# Altium project PROC154E3_SCH.PrjPcb (part 2 of 60)

## Sheet 11. SOC SERDES1 IF.SchDoc: SERDES INTERFACE-2
size 513 x 386 mm; Project: PROC154E2(001)_SK_AM69; Issue: 1.0; RevCode: E3; Page Create Date: March  8, 1995; Variant Name: Core Design; Schematic Page Number: 11; Page Number: 11; Page Size: C; Comment: MISTRAL_TITLEBLK_CSIZE_1; Page Count: 62; Schematic Page Count: 62; Name: PROC154E2 001 SK AM69; DsnPath: C:\Users\danie\Downloads\sprr466c\PROC154E3_RP\PROC154E3_SCH.DSN; SchematicName: SCHEMATIC1; PageName: 11. SOC SERDES1 IF; PageSize: C; TopSchematic: True
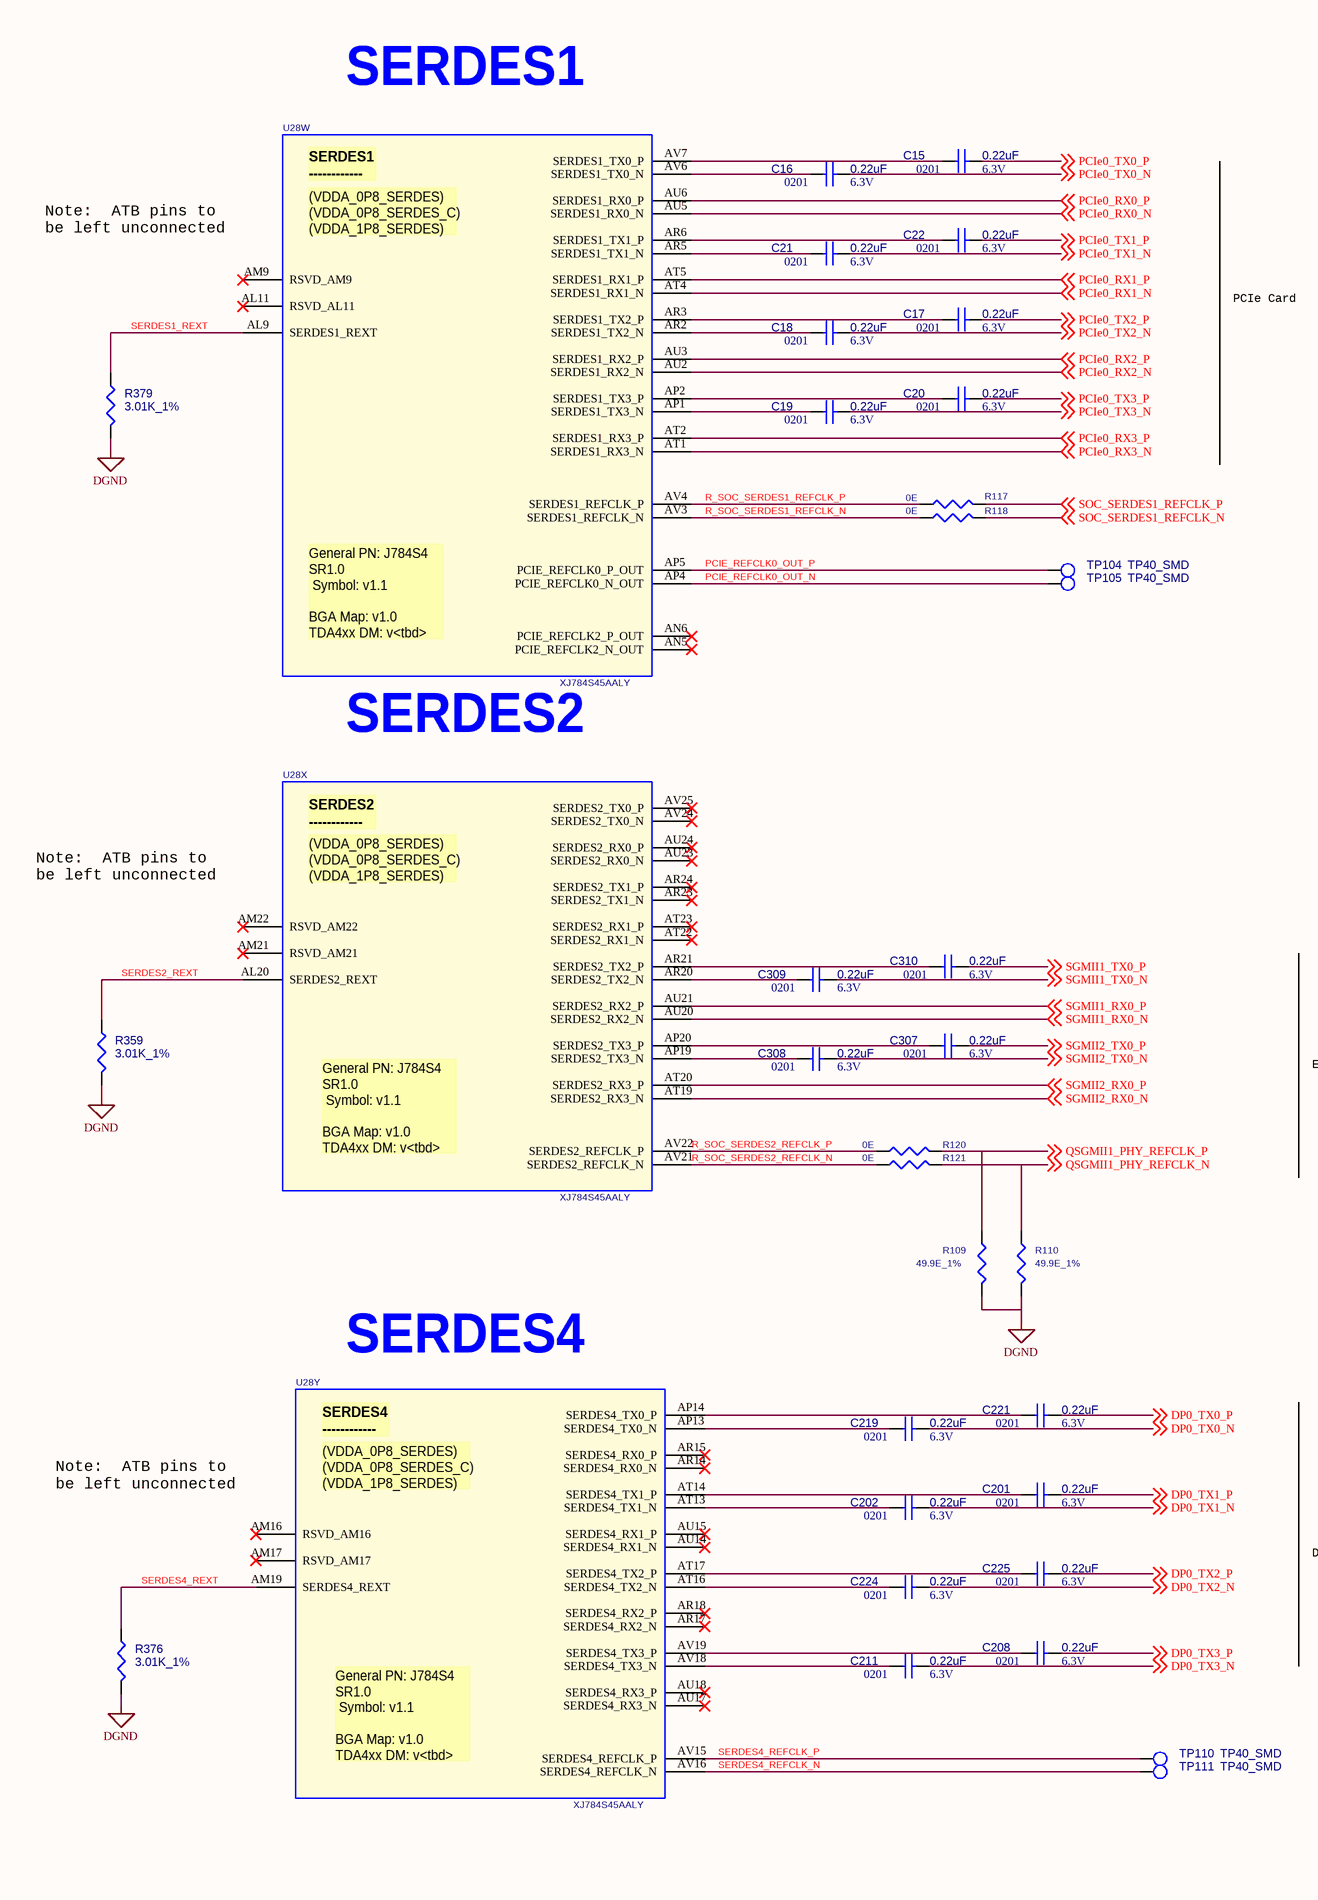
[diagram p12: 11. SOC SERDES1 IF.SchDoc, left]
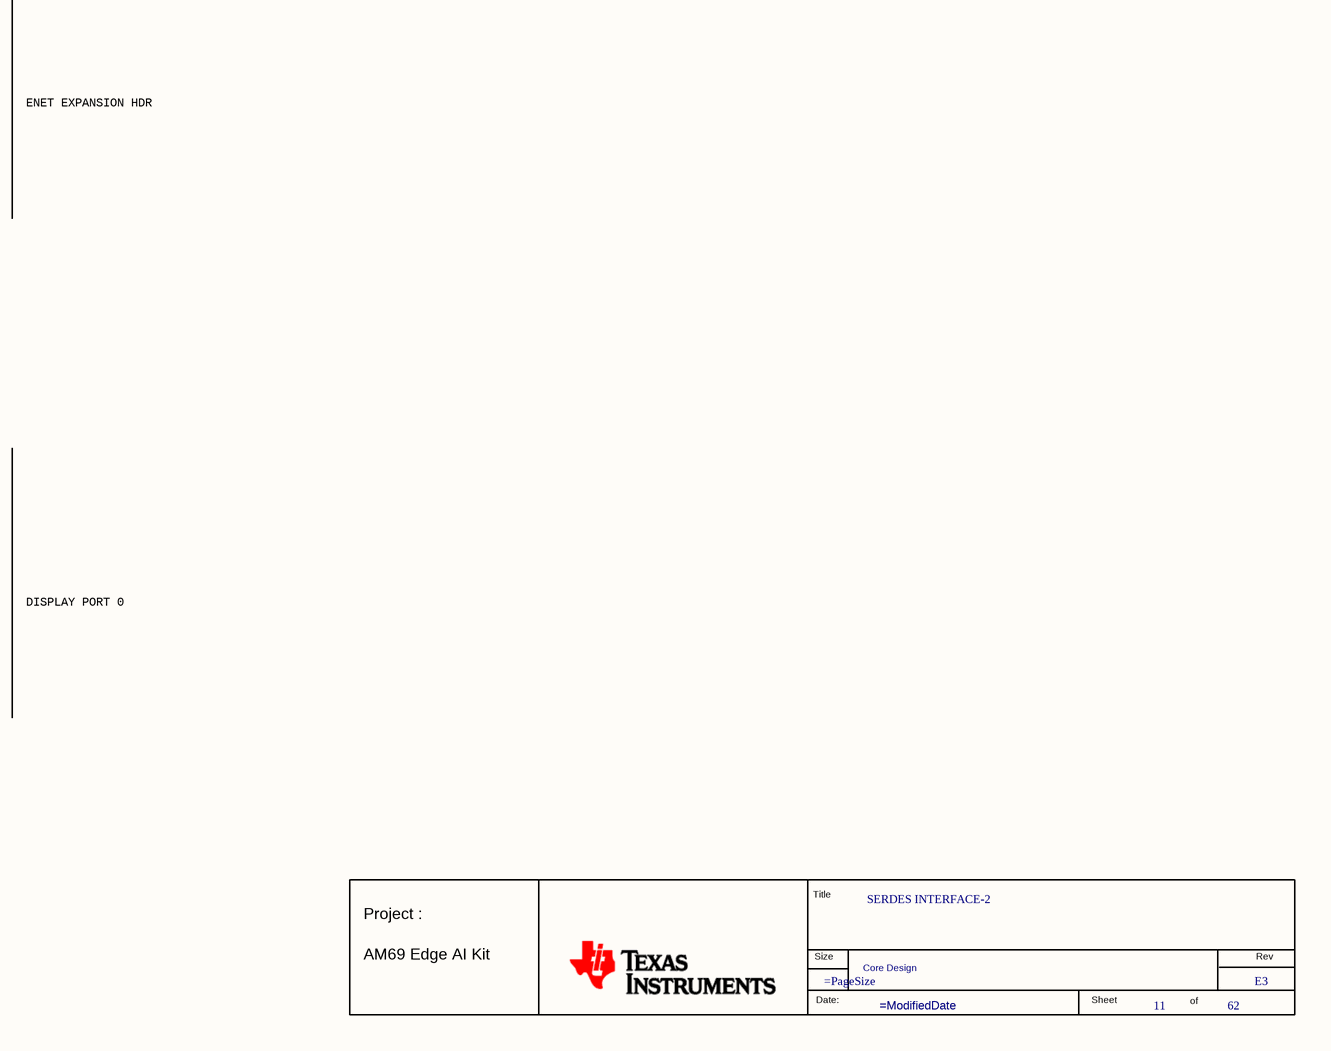
[diagram p13: 11. SOC SERDES1 IF.SchDoc, right]

### Parts
(Parts that share a designator on the sheet are numbered #1, #2 ... from top to bottom, then left to right.)
*#11  RevCode: E3  Title: SERDES INTERFACE-2  Page Number: 11  Page Count: 62  Variant Name: Core Design  (hidden comment: MISTRAL_TITLEBLK_CSIZE_1)  (graphical)
C15  0.22uF  Package: 0201  Voltage: 6.3V  [CAP0201_0-5]
C16  0.22uF  Voltage: 6.3V  Package: 0201  [CAP0201_0-5]
C17  0.22uF  Package: 0201  Voltage: 6.3V  [CAP0201_0-5]
C18  0.22uF  Voltage: 6.3V  Package: 0201  [CAP0201_0-5]
C19  0.22uF  Voltage: 6.3V  Package: 0201  [CAP0201_0-5]
C20  0.22uF  Package: 0201  Voltage: 6.3V  [CAP0201_0-5]
C21  0.22uF  Voltage: 6.3V  Package: 0201  [CAP0201_0-5]
C22  0.22uF  Package: 0201  Voltage: 6.3V  [CAP0201_0-5]
C201  0.22uF  Package: 0201  Voltage: 6.3V  [CAP0201_0-5]
C202  0.22uF  Voltage: 6.3V  Package: 0201  [CAP0201_0-5]
C208  0.22uF  Package: 0201  Voltage: 6.3V  [CAP0201_0-5]
C211  0.22uF  Voltage: 6.3V  Package: 0201  [CAP0201_0-5]
C219  0.22uF  Voltage: 6.3V  Package: 0201  [CAP0201_0-5]
C221  0.22uF  Package: 0201  Voltage: 6.3V  [CAP0201_0-5]
C224  0.22uF  Voltage: 6.3V  Package: 0201  [CAP0201_0-5]
C225  0.22uF  Package: 0201  Voltage: 6.3V  [CAP0201_0-5]
C307  0.22uF  Package: 0201  Voltage: 6.3V  [CAP0201_0-5]
C308  0.22uF  Voltage: 6.3V  Package: 0201  [CAP0201_0-5]
C309  0.22uF  Voltage: 6.3V  Package: 0201  [CAP0201_0-5]
C310  0.22uF  Package: 0201  Voltage: 6.3V  [CAP0201_0-5]
R109  49.9E_1%  [RES0402_0-5]
R110  49.9E_1%  [RES0402_0-5]
R117  0E  [RES0201_0-5]
R118  0E  [RES0201_0-5]
R120  0E  [RES0201_0-5]
R121  0E  [RES0201_0-5]
R359  3.01K_1%  [RES0201_0-5]
R376  3.01K_1%  [RES0201_0-5]
R379  3.01K_1%  [RES0201_0-5]
TP104  TP40_SMD  [TP40_SMD]
TP105  TP40_SMD  [TP40_SMD]
TP110  TP40_SMD  [TP40_SMD]
TP111  TP40_SMD  [TP40_SMD]
U28  XJ784S45AALY  [BGA1414_31-49_1230X1230_2-7]  (parts W,X,Y of 26)

### Nets
DGND: R109.2 R110.2 R359.2 R376.2 R379.2  [project net VDD_CPU_HCPS_GOSNS]
DP0_TX0_N: C219.2 ; off-sheet DP0_TX0_N
DP0_TX0_P: C221.2 ; off-sheet DP0_TX0_P
DP0_TX1_N: C202.2 ; off-sheet DP0_TX1_N
DP0_TX1_P: C201.2 ; off-sheet DP0_TX1_P
DP0_TX2_N: C224.2 ; off-sheet DP0_TX2_N
DP0_TX2_P: C225.2 ; off-sheet DP0_TX2_P
DP0_TX3_N: C211.2 ; off-sheet DP0_TX3_N
DP0_TX3_P: C208.2 ; off-sheet DP0_TX3_P
PCIe0_RX0_N: U28.AU5(SERDES1_RX0_N) ; off-sheet PCIe0_RX0_N
PCIe0_RX0_P: U28.AU6(SERDES1_RX0_P) ; off-sheet PCIe0_RX0_P
PCIe0_RX1_N: U28.AT4(SERDES1_RX1_N) ; off-sheet PCIe0_RX1_N
PCIe0_RX1_P: U28.AT5(SERDES1_RX1_P) ; off-sheet PCIe0_RX1_P
PCIe0_RX2_N: U28.AU2(SERDES1_RX2_N) ; off-sheet PCIe0_RX2_N
PCIe0_RX2_P: U28.AU3(SERDES1_RX2_P) ; off-sheet PCIe0_RX2_P
PCIe0_RX3_N: U28.AT1(SERDES1_RX3_N) ; off-sheet PCIe0_RX3_N
PCIe0_RX3_P: U28.AT2(SERDES1_RX3_P) ; off-sheet PCIe0_RX3_P
PCIe0_TX0_N: C16.2 ; off-sheet PCIe0_TX0_N
PCIe0_TX0_P: C15.2 ; off-sheet PCIe0_TX0_P
PCIe0_TX1_N: C21.2 ; off-sheet PCIe0_TX1_N
PCIe0_TX1_P: C22.2 ; off-sheet PCIe0_TX1_P
PCIe0_TX2_N: C18.2 ; off-sheet PCIe0_TX2_N
PCIe0_TX2_P: C17.2 ; off-sheet PCIe0_TX2_P
PCIe0_TX3_N: C19.2 ; off-sheet PCIe0_TX3_N
PCIe0_TX3_P: C20.2 ; off-sheet PCIe0_TX3_P
PCIE_REFCLK0_OUT_N: TP105.1(TP) U28.AP4(PCIE_REFCLK0_N_OUT)
PCIE_REFCLK0_OUT_P: TP104.1(TP) U28.AP5(PCIE_REFCLK0_P_OUT)
QSGMII1_PHY_REFCLK_N: R110.1 R121.1 ; off-sheet QSGMII1_PHY_REFCLK_N
QSGMII1_PHY_REFCLK_P: R109.1 R120.1 ; off-sheet QSGMII1_PHY_REFCLK_P
R_SOC_SERDES1_REFCLK_N: R118.2 U28.AV3(SERDES1_REFCLK_N)
R_SOC_SERDES1_REFCLK_P: R117.2 U28.AV4(SERDES1_REFCLK_P)
R_SOC_SERDES2_REFCLK_N: R121.2 U28.AV21(SERDES2_REFCLK_N)
R_SOC_SERDES2_REFCLK_P: R120.2 U28.AV22(SERDES2_REFCLK_P)
SERDES1_REXT: R379.1 U28.AL9(SERDES1_REXT)
SERDES2_REXT: R359.1 U28.AL20(SERDES2_REXT)
SERDES4_REFCLK_N: TP111.1(TP) U28.AV16(SERDES4_REFCLK_N)
SERDES4_REFCLK_P: TP110.1(TP) U28.AV15(SERDES4_REFCLK_P)
SERDES4_REXT: R376.1 U28.AM19(SERDES4_REXT)
SGMII1_RX0_N: U28.AU20(SERDES2_RX2_N) ; off-sheet SGMII1_RX0_N
SGMII1_RX0_P: U28.AU21(SERDES2_RX2_P) ; off-sheet SGMII1_RX0_P
SGMII1_TX0_N: C309.2 ; off-sheet SGMII1_TX0_N
SGMII1_TX0_P: C310.2 ; off-sheet SGMII1_TX0_P
SGMII2_RX0_N: U28.AT19(SERDES2_RX3_N) ; off-sheet SGMII2_RX0_N
SGMII2_RX0_P: U28.AT20(SERDES2_RX3_P) ; off-sheet SGMII2_RX0_P
SGMII2_TX0_N: C308.2 ; off-sheet SGMII2_TX0_N
SGMII2_TX0_P: C307.2 ; off-sheet SGMII2_TX0_P
SOC_SERDES1_REFCLK_N: R118.1 ; off-sheet SOC_SERDES1_REFCLK_N
SOC_SERDES1_REFCLK_P: R117.1 ; off-sheet SOC_SERDES1_REFCLK_P
NetC15_1: C15.1 U28.AV7(SERDES1_TX0_P)
NetC16_1: C16.1 U28.AV6(SERDES1_TX0_N)
NetC17_1: C17.1 U28.AR3(SERDES1_TX2_P)
NetC18_1: C18.1 U28.AR2(SERDES1_TX2_N)
NetC19_1: C19.1 U28.AP1(SERDES1_TX3_N)
NetC20_1: C20.1 U28.AP2(SERDES1_TX3_P)
NetC21_1: C21.1 U28.AR5(SERDES1_TX1_N)
NetC22_1: C22.1 U28.AR6(SERDES1_TX1_P)
NetC201_1: C201.1 U28.AT14(SERDES4_TX1_P)
NetC202_1: C202.1 U28.AT13(SERDES4_TX1_N)
NetC208_1: C208.1 U28.AV19(SERDES4_TX3_P)
NetC211_1: C211.1 U28.AV18(SERDES4_TX3_N)
NetC219_1: C219.1 U28.AP13(SERDES4_TX0_N)
NetC221_1: C221.1 U28.AP14(SERDES4_TX0_P)
NetC224_1: C224.1 U28.AT16(SERDES4_TX2_N)
NetC225_1: C225.1 U28.AT17(SERDES4_TX2_P)
NetC307_1: C307.1 U28.AP20(SERDES2_TX3_P)
NetC308_1: C308.1 U28.AP19(SERDES2_TX3_N)
NetC309_1: C309.1 U28.AR20(SERDES2_TX2_N)
NetC310_1: C310.1 U28.AR21(SERDES2_TX2_P)

Not connected (* = marked no-connect by the designer): U28 AL11(RSVD_AL11)* AM9(RSVD_AM9)* AM16(RSVD_AM16)* AM17(RSVD_AM17)* AM21(RSVD_AM21)* AM22(RSVD_AM22)* AN5(PCIE_REFCLK2_N_OUT)* AN6(PCIE_REFCLK2_P_OUT)* AR14(SERDES4_RX0_N)* AR15(SERDES4_RX0_P)* AR17(SERDES4_RX2_N)* AR18(SERDES4_RX2_P)* AR23(SERDES2_TX1_N)* AR24(SERDES2_TX1_P)* AT22(SERDES2_RX1_N)* AT23(SERDES2_RX1_P)* AU14(SERDES4_RX1_N)* AU15(SERDES4_RX1_P)* AU17(SERDES4_RX3_N)* AU18(SERDES4_RX3_P)* AU23(SERDES2_RX0_N)* AU24(SERDES2_RX0_P)* AV24(SERDES2_TX0_N)* AV25(SERDES2_TX0_P)*

### Notes on the sheet
- SERDES1
- (near U28) Note:  ATB pins to
  be left unconnected
- PCIe Card
- (near U28) SERDES2
- ENET EXPANSION HDR
- (near U28) SERDES4
- DISPLAY PORT 0
- (in symbol J7AHPSoC-EVM_BGA1414, part W) SERDES1 / ------------; (VDDA_0P8_SERDES) / (VDDA_0P8_SERDES_C) / (VDDA_1P8_SERDES); General PN: J784S4 / SR1.0 / Symbol: v1.1 / BGA Map: v1.0 / TDA4xx DM: v<tbd>
- (in symbol J7AHPSoC-EVM_BGA1414, part X) SERDES2 / ------------; (VDDA_0P8_SERDES) / (VDDA_0P8_SERDES_C) / (VDDA_1P8_SERDES); General PN: J784S4 / SR1.0 / Symbol: v1.1 / BGA Map: v1.0 / TDA4xx DM: v<tbd>
- (in symbol J7AHPSoC-EVM_BGA1414, part Y) SERDES4 / ------------; (VDDA_0P8_SERDES) / (VDDA_0P8_SERDES_C) / (VDDA_1P8_SERDES); General PN: J784S4 / SR1.0 / Symbol: v1.1 / BGA Map: v1.0 / TDA4xx DM: v<tbd>
- (in symbol MISTRAL_TITLEBLK_CSIZE_1) Title; Project :; Size; Rev; AM69 Edge AI Kit; Date:; Sheet; of

### Library data of the parts
*#11 = MISTRAL_TITLEBLK_CSIZE_1: as *#2 on sheet 02. REVISION HISTORY; Page Create Date: March  8, 1995; Page Size: =PageSize; Page Modify Date: =ModifiedDate; Schematic Page Count: 62; Schematic Page Number: 11
C15 = CAP_Dup1: CAP CERAMIC 0.22uF 6.3V 10% X6S AUTO 0201; Part Reference: C15; Part_type: CAPACITORS\CERAMIC; Mfr_part_number: GRT033C80J224KE01D; Mfr_name: MURATA; Mistral Part No: 120019020011-R; Custom_Duty: 15%; Customs_HS_Code: 85322990; Wattage: NA; Project: TI_J7ES_EVM_SOM; SIGNAL_MODEL: CAP_CAP0201_0-5_0.22UF_0.22uF; Value: 0.22uF; PCB Footprint: CAP0201_0-5; Footprint Path: Y:\MIS_DATABASE\Library\ALTIUM_TOOL\PCB_FOOTPRINTS\Altium_Footprint_Lib.PcbLib; Library Path: Y:\MIS_DATABASE\Library\ALTIUM_TOOL\SCHEMATICS_PARTS\MS_DISCRETE_Library.schlib; Footprint Ref: CAP0201_0-5; Chkd/date: MANIRAJA/220219; Crtd /date: ALVY/220219; Datasheet: Y:\MIS_DATABASE\DATASHEETS\CAPACITORS\MURATA-GCM-SER.PDF; Temperature: -55°C+105°C; Weight: 0.17mg; Height: 0.33MM; Library Ref: CAP; Distributor_part_number: 490-12230-1-ND; Distributor_name: DIGIKEY; Tolerance: 10%; MECHANICAL 3D STEP FILE: CAP0201_0-5; Manufacturer: MURATA
C16 = CAP_Dup1: CAP CERAMIC 0.22uF 6.3V 10% X6S AUTO 0201; Part Reference: C16; Manufacturer: MURATA; Mistral Part No: 120019020011-R; Mfr_part_number: GRT033C80J224KE01D; Part_type: CAPACITORS\CERAMIC; Project: TI_J7ES_EVM_SOM; Wattage: NA; Customs_HS_Code: 85322990; Custom_Duty: 15%; SIGNAL_MODEL: CAP_CAP0201_0-5_0.22UF_0.22uF; Value: 0.22uF; PCB Footprint: CAP0201_0-5; MECHANICAL 3D STEP FILE: CAP0201_0-5; Mfr_name: MURATA; Tolerance: 10%; Distributor_name: DIGIKEY; Distributor_part_number: 490-12230-1-ND; Library Ref: CAP; Height: 0.33MM; Weight: 0.17mg; Temperature: -55°C+105°C; Datasheet: Y:\MIS_DATABASE\DATASHEETS\CAPACITORS\MURATA-GCM-SER.PDF; Crtd /date: ALVY/220219; Chkd/date: MANIRAJA/220219; Footprint Ref: CAP0201_0-5; Library Path: Y:\MIS_DATABASE\Library\ALTIUM_TOOL\SCHEMATICS_PARTS\MS_DISCRETE_Library.schlib; Footprint Path: Y:\MIS_DATABASE\Library\ALTIUM_TOOL\PCB_FOOTPRINTS\Altium_Footprint_Lib.PcbLib
C17 = CAP_Dup1: CAP CERAMIC 0.22uF 6.3V 10% X6S AUTO 0201; Part Reference: C17; Part_type: CAPACITORS\CERAMIC; Mfr_part_number: GRT033C80J224KE01D; Mfr_name: MURATA; Mistral Part No: 120019020011-R; Custom_Duty: 15%; Customs_HS_Code: 85322990; Wattage: NA; Project: TI_J7ES_EVM_SOM; SIGNAL_MODEL: CAP_CAP0201_0-5_0.22UF_0.22uF; Value: 0.22uF; PCB Footprint: CAP0201_0-5; Footprint Path: Y:\MIS_DATABASE\Library\ALTIUM_TOOL\PCB_FOOTPRINTS\Altium_Footprint_Lib.PcbLib; Library Path: Y:\MIS_DATABASE\Library\ALTIUM_TOOL\SCHEMATICS_PARTS\MS_DISCRETE_Library.schlib; Footprint Ref: CAP0201_0-5; Chkd/date: MANIRAJA/220219; Crtd /date: ALVY/220219; Datasheet: Y:\MIS_DATABASE\DATASHEETS\CAPACITORS\MURATA-GCM-SER.PDF; Temperature: -55°C+105°C; Weight: 0.17mg; Height: 0.33MM; Library Ref: CAP; Distributor_part_number: 490-12230-1-ND; Distributor_name: DIGIKEY; Tolerance: 10%; MECHANICAL 3D STEP FILE: CAP0201_0-5; Manufacturer: MURATA
C18 = CAP_Dup1: CAP CERAMIC 0.22uF 6.3V 10% X6S AUTO 0201; Part Reference: C18; Manufacturer: MURATA; Mistral Part No: 120019020011-R; Mfr_part_number: GRT033C80J224KE01D; Part_type: CAPACITORS\CERAMIC; Project: TI_J7ES_EVM_SOM; Wattage: NA; Customs_HS_Code: 85322990; Custom_Duty: 15%; SIGNAL_MODEL: CAP_CAP0201_0-5_0.22UF_0.22uF; Value: 0.22uF; PCB Footprint: CAP0201_0-5; MECHANICAL 3D STEP FILE: CAP0201_0-5; Mfr_name: MURATA; Tolerance: 10%; Distributor_name: DIGIKEY; Distributor_part_number: 490-12230-1-ND; Library Ref: CAP; Height: 0.33MM; Weight: 0.17mg; Temperature: -55°C+105°C; Datasheet: Y:\MIS_DATABASE\DATASHEETS\CAPACITORS\MURATA-GCM-SER.PDF; Crtd /date: ALVY/220219; Chkd/date: MANIRAJA/220219; Footprint Ref: CAP0201_0-5; Library Path: Y:\MIS_DATABASE\Library\ALTIUM_TOOL\SCHEMATICS_PARTS\MS_DISCRETE_Library.schlib; Footprint Path: Y:\MIS_DATABASE\Library\ALTIUM_TOOL\PCB_FOOTPRINTS\Altium_Footprint_Lib.PcbLib
C19 = CAP_Dup1: CAP CERAMIC 0.22uF 6.3V 10% X6S AUTO 0201; Part Reference: C19; Manufacturer: MURATA; Mistral Part No: 120019020011-R; Mfr_part_number: GRT033C80J224KE01D; Part_type: CAPACITORS\CERAMIC; Project: TI_J7ES_EVM_SOM; Wattage: NA; Customs_HS_Code: 85322990; Custom_Duty: 15%; SIGNAL_MODEL: CAP_CAP0201_0-5_0.22UF_0.22uF; Value: 0.22uF; PCB Footprint: CAP0201_0-5; MECHANICAL 3D STEP FILE: CAP0201_0-5; Mfr_name: MURATA; Tolerance: 10%; Distributor_name: DIGIKEY; Distributor_part_number: 490-12230-1-ND; Library Ref: CAP; Height: 0.33MM; Weight: 0.17mg; Temperature: -55°C+105°C; Datasheet: Y:\MIS_DATABASE\DATASHEETS\CAPACITORS\MURATA-GCM-SER.PDF; Crtd /date: ALVY/220219; Chkd/date: MANIRAJA/220219; Footprint Ref: CAP0201_0-5; Library Path: Y:\MIS_DATABASE\Library\ALTIUM_TOOL\SCHEMATICS_PARTS\MS_DISCRETE_Library.schlib; Footprint Path: Y:\MIS_DATABASE\Library\ALTIUM_TOOL\PCB_FOOTPRINTS\Altium_Footprint_Lib.PcbLib
C20 = CAP_Dup1: CAP CERAMIC 0.22uF 6.3V 10% X6S AUTO 0201; Part Reference: C20; Part_type: CAPACITORS\CERAMIC; Mfr_part_number: GRT033C80J224KE01D; Mfr_name: MURATA; Mistral Part No: 120019020011-R; Custom_Duty: 15%; Customs_HS_Code: 85322990; Wattage: NA; Project: TI_J7ES_EVM_SOM; SIGNAL_MODEL: CAP_CAP0201_0-5_0.22UF_0.22uF; Value: 0.22uF; PCB Footprint: CAP0201_0-5; Footprint Path: Y:\MIS_DATABASE\Library\ALTIUM_TOOL\PCB_FOOTPRINTS\Altium_Footprint_Lib.PcbLib; Library Path: Y:\MIS_DATABASE\Library\ALTIUM_TOOL\SCHEMATICS_PARTS\MS_DISCRETE_Library.schlib; Footprint Ref: CAP0201_0-5; Chkd/date: MANIRAJA/220219; Crtd /date: ALVY/220219; Datasheet: Y:\MIS_DATABASE\DATASHEETS\CAPACITORS\MURATA-GCM-SER.PDF; Temperature: -55°C+105°C; Weight: 0.17mg; Height: 0.33MM; Library Ref: CAP; Distributor_part_number: 490-12230-1-ND; Distributor_name: DIGIKEY; Tolerance: 10%; MECHANICAL 3D STEP FILE: CAP0201_0-5; Manufacturer: MURATA
C21 = CAP_Dup1: CAP CERAMIC 0.22uF 6.3V 10% X6S AUTO 0201; Part Reference: C21; Manufacturer: MURATA; Mistral Part No: 120019020011-R; Mfr_part_number: GRT033C80J224KE01D; Part_type: CAPACITORS\CERAMIC; Project: TI_J7ES_EVM_SOM; Wattage: NA; Customs_HS_Code: 85322990; Custom_Duty: 15%; SIGNAL_MODEL: CAP_CAP0201_0-5_0.22UF_0.22uF; Value: 0.22uF; PCB Footprint: CAP0201_0-5; MECHANICAL 3D STEP FILE: CAP0201_0-5; Mfr_name: MURATA; Tolerance: 10%; Distributor_name: DIGIKEY; Distributor_part_number: 490-12230-1-ND; Library Ref: CAP; Height: 0.33MM; Weight: 0.17mg; Temperature: -55°C+105°C; Datasheet: Y:\MIS_DATABASE\DATASHEETS\CAPACITORS\MURATA-GCM-SER.PDF; Crtd /date: ALVY/220219; Chkd/date: MANIRAJA/220219; Footprint Ref: CAP0201_0-5; Library Path: Y:\MIS_DATABASE\Library\ALTIUM_TOOL\SCHEMATICS_PARTS\MS_DISCRETE_Library.schlib; Footprint Path: Y:\MIS_DATABASE\Library\ALTIUM_TOOL\PCB_FOOTPRINTS\Altium_Footprint_Lib.PcbLib
C22 = CAP_Dup1: CAP CERAMIC 0.22uF 6.3V 10% X6S AUTO 0201; Part Reference: C22; Part_type: CAPACITORS\CERAMIC; Mfr_part_number: GRT033C80J224KE01D; Mfr_name: MURATA; Mistral Part No: 120019020011-R; Custom_Duty: 15%; Customs_HS_Code: 85322990; Wattage: NA; Project: TI_J7ES_EVM_SOM; SIGNAL_MODEL: CAP_CAP0201_0-5_0.22UF_0.22uF; Value: 0.22uF; PCB Footprint: CAP0201_0-5; Footprint Path: Y:\MIS_DATABASE\Library\ALTIUM_TOOL\PCB_FOOTPRINTS\Altium_Footprint_Lib.PcbLib; Library Path: Y:\MIS_DATABASE\Library\ALTIUM_TOOL\SCHEMATICS_PARTS\MS_DISCRETE_Library.schlib; Footprint Ref: CAP0201_0-5; Chkd/date: MANIRAJA/220219; Crtd /date: ALVY/220219; Datasheet: Y:\MIS_DATABASE\DATASHEETS\CAPACITORS\MURATA-GCM-SER.PDF; Temperature: -55°C+105°C; Weight: 0.17mg; Height: 0.33MM; Library Ref: CAP; Distributor_part_number: 490-12230-1-ND; Distributor_name: DIGIKEY; Tolerance: 10%; MECHANICAL 3D STEP FILE: CAP0201_0-5; Manufacturer: MURATA
C201 = CAP_Dup1: CAP CERAMIC 0.22uF 6.3V 10% X6S AUTO 0201; Part Reference: C201; Part_type: CAPACITORS\CERAMIC; Mfr_part_number: GRT033C80J224KE01D; Mfr_name: MURATA; Mistral Part No: 120019020011-R; Custom_Duty: 15%; Customs_HS_Code: 85322990; Wattage: NA; Project: TI_J7ES_EVM_SOM; SIGNAL_MODEL: CAP_CAP0201_0-5_0.22UF_0.22uF; Value: 0.22uF; PCB Footprint: CAP0201_0-5; Footprint Path: Y:\MIS_DATABASE\Library\ALTIUM_TOOL\PCB_FOOTPRINTS\Altium_Footprint_Lib.PcbLib; Library Path: Y:\MIS_DATABASE\Library\ALTIUM_TOOL\SCHEMATICS_PARTS\MS_DISCRETE_Library.schlib; Footprint Ref: CAP0201_0-5; Chkd/date: MANIRAJA/220219; Crtd /date: ALVY/220219; Datasheet: Y:\MIS_DATABASE\DATASHEETS\CAPACITORS\MURATA-GCM-SER.PDF; Temperature: -55°C+105°C; Weight: 0.17mg; Height: 0.33MM; Library Ref: CAP; Distributor_part_number: 490-12230-1-ND; Distributor_name: DIGIKEY; Tolerance: 10%; MECHANICAL 3D STEP FILE: CAP0201_0-5; Manufacturer: MURATA
C202 = CAP_Dup1: CAP CERAMIC 0.22uF 6.3V 10% X6S AUTO 0201; Part Reference: C202; Manufacturer: MURATA; Mistral Part No: 120019020011-R; Mfr_part_number: GRT033C80J224KE01D; Part_type: CAPACITORS\CERAMIC; Project: TI_J7ES_EVM_SOM; Wattage: NA; Customs_HS_Code: 85322990; Custom_Duty: 15%; SIGNAL_MODEL: CAP_CAP0201_0-5_0.22UF_0.22uF; Value: 0.22uF; PCB Footprint: CAP0201_0-5; MECHANICAL 3D STEP FILE: CAP0201_0-5; Mfr_name: MURATA; Tolerance: 10%; Distributor_name: DIGIKEY; Distributor_part_number: 490-12230-1-ND; Library Ref: CAP; Height: 0.33MM; Weight: 0.17mg; Temperature: -55°C+105°C; Datasheet: Y:\MIS_DATABASE\DATASHEETS\CAPACITORS\MURATA-GCM-SER.PDF; Crtd /date: ALVY/220219; Chkd/date: MANIRAJA/220219; Footprint Ref: CAP0201_0-5; Library Path: Y:\MIS_DATABASE\Library\ALTIUM_TOOL\SCHEMATICS_PARTS\MS_DISCRETE_Library.schlib; Footprint Path: Y:\MIS_DATABASE\Library\ALTIUM_TOOL\PCB_FOOTPRINTS\Altium_Footprint_Lib.PcbLib
C208 = CAP_Dup1: CAP CERAMIC 0.22uF 6.3V 10% X6S AUTO 0201; Part Reference: C208; Part_type: CAPACITORS\CERAMIC; Mfr_part_number: GRT033C80J224KE01D; Mfr_name: MURATA; Mistral Part No: 120019020011-R; Custom_Duty: 15%; Customs_HS_Code: 85322990; Wattage: NA; Project: TI_J7ES_EVM_SOM; SIGNAL_MODEL: CAP_CAP0201_0-5_0.22UF_0.22uF; Value: 0.22uF; PCB Footprint: CAP0201_0-5; Footprint Path: Y:\MIS_DATABASE\Library\ALTIUM_TOOL\PCB_FOOTPRINTS\Altium_Footprint_Lib.PcbLib; Library Path: Y:\MIS_DATABASE\Library\ALTIUM_TOOL\SCHEMATICS_PARTS\MS_DISCRETE_Library.schlib; Footprint Ref: CAP0201_0-5; Chkd/date: MANIRAJA/220219; Crtd /date: ALVY/220219; Datasheet: Y:\MIS_DATABASE\DATASHEETS\CAPACITORS\MURATA-GCM-SER.PDF; Temperature: -55°C+105°C; Weight: 0.17mg; Height: 0.33MM; Library Ref: CAP; Distributor_part_number: 490-12230-1-ND; Distributor_name: DIGIKEY; Tolerance: 10%; MECHANICAL 3D STEP FILE: CAP0201_0-5; Manufacturer: MURATA
C211 = CAP_Dup1: CAP CERAMIC 0.22uF 6.3V 10% X6S AUTO 0201; Part Reference: C211; Manufacturer: MURATA; Mistral Part No: 120019020011-R; Mfr_part_number: GRT033C80J224KE01D; Part_type: CAPACITORS\CERAMIC; Project: TI_J7ES_EVM_SOM; Wattage: NA; Customs_HS_Code: 85322990; Custom_Duty: 15%; SIGNAL_MODEL: CAP_CAP0201_0-5_0.22UF_0.22uF; Value: 0.22uF; PCB Footprint: CAP0201_0-5; MECHANICAL 3D STEP FILE: CAP0201_0-5; Mfr_name: MURATA; Tolerance: 10%; Distributor_name: DIGIKEY; Distributor_part_number: 490-12230-1-ND; Library Ref: CAP; Height: 0.33MM; Weight: 0.17mg; Temperature: -55°C+105°C; Datasheet: Y:\MIS_DATABASE\DATASHEETS\CAPACITORS\MURATA-GCM-SER.PDF; Crtd /date: ALVY/220219; Chkd/date: MANIRAJA/220219; Footprint Ref: CAP0201_0-5; Library Path: Y:\MIS_DATABASE\Library\ALTIUM_TOOL\SCHEMATICS_PARTS\MS_DISCRETE_Library.schlib; Footprint Path: Y:\MIS_DATABASE\Library\ALTIUM_TOOL\PCB_FOOTPRINTS\Altium_Footprint_Lib.PcbLib
C219 = CAP_Dup1: CAP CERAMIC 0.22uF 6.3V 10% X6S AUTO 0201; Part Reference: C219; Manufacturer: MURATA; Mistral Part No: 120019020011-R; Mfr_part_number: GRT033C80J224KE01D; Part_type: CAPACITORS\CERAMIC; Project: TI_J7ES_EVM_SOM; Wattage: NA; Customs_HS_Code: 85322990; Custom_Duty: 15%; SIGNAL_MODEL: CAP_CAP0201_0-5_0.22UF_0.22uF; Value: 0.22uF; PCB Footprint: CAP0201_0-5; MECHANICAL 3D STEP FILE: CAP0201_0-5; Mfr_name: MURATA; Tolerance: 10%; Distributor_name: DIGIKEY; Distributor_part_number: 490-12230-1-ND; Library Ref: CAP; Height: 0.33MM; Weight: 0.17mg; Temperature: -55°C+105°C; Datasheet: Y:\MIS_DATABASE\DATASHEETS\CAPACITORS\MURATA-GCM-SER.PDF; Crtd /date: ALVY/220219; Chkd/date: MANIRAJA/220219; Footprint Ref: CAP0201_0-5; Library Path: Y:\MIS_DATABASE\Library\ALTIUM_TOOL\SCHEMATICS_PARTS\MS_DISCRETE_Library.schlib; Footprint Path: Y:\MIS_DATABASE\Library\ALTIUM_TOOL\PCB_FOOTPRINTS\Altium_Footprint_Lib.PcbLib
C221 = CAP_Dup1: CAP CERAMIC 0.22uF 6.3V 10% X6S AUTO 0201; Part Reference: C221; Part_type: CAPACITORS\CERAMIC; Mfr_part_number: GRT033C80J224KE01D; Mfr_name: MURATA; Mistral Part No: 120019020011-R; Custom_Duty: 15%; Customs_HS_Code: 85322990; Wattage: NA; Project: TI_J7ES_EVM_SOM; SIGNAL_MODEL: CAP_CAP0201_0-5_0.22UF_0.22uF; Value: 0.22uF; PCB Footprint: CAP0201_0-5; Footprint Path: Y:\MIS_DATABASE\Library\ALTIUM_TOOL\PCB_FOOTPRINTS\Altium_Footprint_Lib.PcbLib; Library Path: Y:\MIS_DATABASE\Library\ALTIUM_TOOL\SCHEMATICS_PARTS\MS_DISCRETE_Library.schlib; Footprint Ref: CAP0201_0-5; Chkd/date: MANIRAJA/220219; Crtd /date: ALVY/220219; Datasheet: Y:\MIS_DATABASE\DATASHEETS\CAPACITORS\MURATA-GCM-SER.PDF; Temperature: -55°C+105°C; Weight: 0.17mg; Height: 0.33MM; Library Ref: CAP; Distributor_part_number: 490-12230-1-ND; Distributor_name: DIGIKEY; Tolerance: 10%; MECHANICAL 3D STEP FILE: CAP0201_0-5; Manufacturer: MURATA
C224 = CAP_Dup1: CAP CERAMIC 0.22uF 6.3V 10% X6S AUTO 0201; Part Reference: C224; Manufacturer: MURATA; Mistral Part No: 120019020011-R; Mfr_part_number: GRT033C80J224KE01D; Part_type: CAPACITORS\CERAMIC; Project: TI_J7ES_EVM_SOM; Wattage: NA; Customs_HS_Code: 85322990; Custom_Duty: 15%; SIGNAL_MODEL: CAP_CAP0201_0-5_0.22UF_0.22uF; Value: 0.22uF; PCB Footprint: CAP0201_0-5; MECHANICAL 3D STEP FILE: CAP0201_0-5; Mfr_name: MURATA; Tolerance: 10%; Distributor_name: DIGIKEY; Distributor_part_number: 490-12230-1-ND; Library Ref: CAP; Height: 0.33MM; Weight: 0.17mg; Temperature: -55°C+105°C; Datasheet: Y:\MIS_DATABASE\DATASHEETS\CAPACITORS\MURATA-GCM-SER.PDF; Crtd /date: ALVY/220219; Chkd/date: MANIRAJA/220219; Footprint Ref: CAP0201_0-5; Library Path: Y:\MIS_DATABASE\Library\ALTIUM_TOOL\SCHEMATICS_PARTS\MS_DISCRETE_Library.schlib; Footprint Path: Y:\MIS_DATABASE\Library\ALTIUM_TOOL\PCB_FOOTPRINTS\Altium_Footprint_Lib.PcbLib
C225 = CAP_Dup1: CAP CERAMIC 0.22uF 6.3V 10% X6S AUTO 0201; Part Reference: C225; Part_type: CAPACITORS\CERAMIC; Mfr_part_number: GRT033C80J224KE01D; Mfr_name: MURATA; Mistral Part No: 120019020011-R; Custom_Duty: 15%; Customs_HS_Code: 85322990; Wattage: NA; Project: TI_J7ES_EVM_SOM; SIGNAL_MODEL: CAP_CAP0201_0-5_0.22UF_0.22uF; Value: 0.22uF; PCB Footprint: CAP0201_0-5; Footprint Path: Y:\MIS_DATABASE\Library\ALTIUM_TOOL\PCB_FOOTPRINTS\Altium_Footprint_Lib.PcbLib; Library Path: Y:\MIS_DATABASE\Library\ALTIUM_TOOL\SCHEMATICS_PARTS\MS_DISCRETE_Library.schlib; Footprint Ref: CAP0201_0-5; Chkd/date: MANIRAJA/220219; Crtd /date: ALVY/220219; Datasheet: Y:\MIS_DATABASE\DATASHEETS\CAPACITORS\MURATA-GCM-SER.PDF; Temperature: -55°C+105°C; Weight: 0.17mg; Height: 0.33MM; Library Ref: CAP; Distributor_part_number: 490-12230-1-ND; Distributor_name: DIGIKEY; Tolerance: 10%; MECHANICAL 3D STEP FILE: CAP0201_0-5; Manufacturer: MURATA
C307 = CAP_Dup1: CAP CERAMIC 0.22uF 6.3V 10% X6S AUTO 0201; Part Reference: C307; Part_type: CAPACITORS\CERAMIC; Mfr_part_number: GRT033C80J224KE01D; Mfr_name: MURATA; Mistral Part No: 120019020011-R; Custom_Duty: 15%; Customs_HS_Code: 85322990; Wattage: NA; Project: TI_J7ES_EVM_SOM; SIGNAL_MODEL: CAP_CAP0201_0-5_0.22UF_0.22uF; Value: 0.22uF; Footprint Path: Y:\MIS_DATABASE\Library\ALTIUM_TOOL\PCB_FOOTPRINTS\Altium_Footprint_Lib.PcbLib; Library Path: Y:\MIS_DATABASE\Library\ALTIUM_TOOL\SCHEMATICS_PARTS\MS_DISCRETE_Library.schlib; Footprint Ref: CAP0201_0-5; Chkd/date: MANIRAJA/220219; Crtd /date: ALVY/220219; Datasheet: Y:\MIS_DATABASE\DATASHEETS\CAPACITORS\MURATA-GCM-SER.PDF; Temperature: -55°C+105°C; Weight: 0.17mg; Height: 0.33MM; Library Ref: CAP; Distributor_part_number: 490-12230-1-ND; Distributor_name: DIGIKEY; Tolerance: 10%; MECHANICAL 3D STEP FILE: CAP0201_0-5; Manufacturer: MURATA; PCB Footprint: CAP0201_0-5
C308 = CAP_Dup1: CAP CERAMIC 0.22uF 6.3V 10% X6S AUTO 0201; Part Reference: C308; Manufacturer: MURATA; Mistral Part No: 120019020011-R; Mfr_part_number: GRT033C80J224KE01D; Part_type: CAPACITORS\CERAMIC; Project: TI_J7ES_EVM_SOM; Wattage: NA; Customs_HS_Code: 85322990; Custom_Duty: 15%; SIGNAL_MODEL: CAP_CAP0201_0-5_0.22UF_0.22uF; Value: 0.22uF; MECHANICAL 3D STEP FILE: CAP0201_0-5; Mfr_name: MURATA; Tolerance: 10%; Distributor_name: DIGIKEY; Distributor_part_number: 490-12230-1-ND; Library Ref: CAP; Height: 0.33MM; Weight: 0.17mg; Temperature: -55°C+105°C; Datasheet: Y:\MIS_DATABASE\DATASHEETS\CAPACITORS\MURATA-GCM-SER.PDF; Crtd /date: ALVY/220219; Chkd/date: MANIRAJA/220219; Footprint Ref: CAP0201_0-5; Library Path: Y:\MIS_DATABASE\Library\ALTIUM_TOOL\SCHEMATICS_PARTS\MS_DISCRETE_Library.schlib; Footprint Path: Y:\MIS_DATABASE\Library\ALTIUM_TOOL\PCB_FOOTPRINTS\Altium_Footprint_Lib.PcbLib; PCB Footprint: CAP0201_0-5
C309 = CAP_Dup1: CAP CERAMIC 0.22uF 6.3V 10% X6S AUTO 0201; Part Reference: C309; Manufacturer: MURATA; Mistral Part No: 120019020011-R; Mfr_part_number: GRT033C80J224KE01D; Part_type: CAPACITORS\CERAMIC; Project: TI_J7ES_EVM_SOM; Wattage: NA; Customs_HS_Code: 85322990; Custom_Duty: 15%; SIGNAL_MODEL: CAP_CAP0201_0-5_0.22UF_0.22uF; Value: 0.22uF; MECHANICAL 3D STEP FILE: CAP0201_0-5; Mfr_name: MURATA; Tolerance: 10%; Distributor_name: DIGIKEY; Distributor_part_number: 490-12230-1-ND; Library Ref: CAP; Height: 0.33MM; Weight: 0.17mg; Temperature: -55°C+105°C; Datasheet: Y:\MIS_DATABASE\DATASHEETS\CAPACITORS\MURATA-GCM-SER.PDF; Crtd /date: ALVY/220219; Chkd/date: MANIRAJA/220219; Footprint Ref: CAP0201_0-5; Library Path: Y:\MIS_DATABASE\Library\ALTIUM_TOOL\SCHEMATICS_PARTS\MS_DISCRETE_Library.schlib; Footprint Path: Y:\MIS_DATABASE\Library\ALTIUM_TOOL\PCB_FOOTPRINTS\Altium_Footprint_Lib.PcbLib; PCB Footprint: CAP0201_0-5
C310 = CAP_Dup1: CAP CERAMIC 0.22uF 6.3V 10% X6S AUTO 0201; Part Reference: C310; Part_type: CAPACITORS\CERAMIC; Mfr_part_number: GRT033C80J224KE01D; Mfr_name: MURATA; Mistral Part No: 120019020011-R; Custom_Duty: 15%; Customs_HS_Code: 85322990; Wattage: NA; Project: TI_J7ES_EVM_SOM; SIGNAL_MODEL: CAP_CAP0201_0-5_0.22UF_0.22uF; Value: 0.22uF; Footprint Path: Y:\MIS_DATABASE\Library\ALTIUM_TOOL\PCB_FOOTPRINTS\Altium_Footprint_Lib.PcbLib; Library Path: Y:\MIS_DATABASE\Library\ALTIUM_TOOL\SCHEMATICS_PARTS\MS_DISCRETE_Library.schlib; Footprint Ref: CAP0201_0-5; Chkd/date: MANIRAJA/220219; Crtd /date: ALVY/220219; Datasheet: Y:\MIS_DATABASE\DATASHEETS\CAPACITORS\MURATA-GCM-SER.PDF; Temperature: -55°C+105°C; Weight: 0.17mg; Height: 0.33MM; Library Ref: CAP; Distributor_part_number: 490-12230-1-ND; Distributor_name: DIGIKEY; Tolerance: 10%; MECHANICAL 3D STEP FILE: CAP0201_0-5; Manufacturer: MURATA; PCB Footprint: CAP0201_0-5
R109 = RESISTOR: RES 49.9E 1/10W 1% 0402; Part Reference: R109; Part_type: RESISTORS\FIXED; Mfr_part_number: ERJ-2RKF49R9X; Mfr_name: PANASONIC-ECG; Mistral Part No: 110009030897-R; Custom_Duty: 15%; Customs_HS_Code: 85332119; Voltage: NA; Project: RED EYE; Value: 49.9E_1%; PCB Footprint: RES0402_0-5; Footprint Ref: RES0402_0-5; Library Ref: RESISTOR; Footprint Path: Y:\MIS_DATABASE\Library\ALTIUM_TOOL\PCB_FOOTPRINTS\Altium_Footprint_Lib.PcbLib; Library Path: Y:\MIS_DATABASE\Library\ALTIUM_TOOL\SCHEMATICS_PARTS\MS_DISCRETE_Library.schlib; MECHANICAL 3D STEP FILE: RES0402_0-5; Chkd/date: VASANTHA/201216; Crtd /date: MAZHAR/201005; Datasheet: Y:\MIS_DATABASE\DATASHEETS\RESISTORS\PAN-ERJSER_NOV17.PDF; Temperature: -55°C+155°C; Weight: 0.8mg; Height: 0.40MM; Distributor_part_number: P49.9LCT-ND; Distributor_name: DIGIKEY; Package: 0402; Wattage: 1/10W; Tolerance: 1%; Manufacturer: PANASONIC-ECG
R110 = RESISTOR: RES 49.9E 1/10W 1% 0402; Part Reference: R110; Mistral Part No: 110009030897-R; Mfr_name: PANASONIC-ECG; Mfr_part_number: ERJ-2RKF49R9X; Part_type: RESISTORS\FIXED; Project: RED EYE; Voltage: NA; Customs_HS_Code: 85332119; Custom_Duty: 15%; Value: 49.9E_1%; PCB Footprint: RES0402_0-5; Footprint Path: Y:\MIS_DATABASE\Library\ALTIUM_TOOL\PCB_FOOTPRINTS\Altium_Footprint_Lib.PcbLib; Library Path: Y:\MIS_DATABASE\Library\ALTIUM_TOOL\SCHEMATICS_PARTS\MS_DISCRETE_Library.schlib; Tolerance: 1%; Wattage: 1/10W; Package: 0402; Distributor_name: DIGIKEY; Distributor_part_number: P49.9LCT-ND; Height: 0.40MM; Weight: 0.8mg; Temperature: -55°C+155°C; Datasheet: Y:\MIS_DATABASE\DATASHEETS\RESISTORS\PAN-ERJSER_NOV17.PDF; Crtd /date: MAZHAR/201005; Chkd/date: VASANTHA/201216; MECHANICAL 3D STEP FILE: RES0402_0-5; Library Ref: RESISTOR; Footprint Ref: RES0402_0-5; Manufacturer: PANASONIC-ECG
R117 = RESISTOR: RES 0E 1/20W 5% 0201; Part Reference: R117; Manufacturer: YAGEO AMERICA; Part_type: RESISTORS\FIXED; Mfr_part_number: RC0201JR-070RL; Mistral Part No: 110010070067-R; Custom_Duty: 15%; Customs_HS_Code: 85332119; Voltage: NA; Project: PB_BUGBASE; Value: 0E; PCB Footprint: RES0201_0-5; Footprint Path: Y:\MIS_DATABASE\Library\ALTIUM_TOOL\PCB_FOOTPRINTS\Altium_Footprint_Lib.PcbLib; Library Path: Y:\MIS_DATABASE\Library\ALTIUM_TOOL\SCHEMATICS_PARTS\MS_DISCRETE_Library.schlib; MECHANICAL 3D STEP FILE: RES0201_0-5; Chkd/date: NAVEED/301214; Crtd /date: MUDDU/120710; Datasheet: Y:\MIS_DATABASE\DATASHEETS\RESISTORS\RCXXXXL-SER_MAR18.PDF; Temperature: -55°C+125°C; Weight: 0.17mg; Height: 0.26MM; Library Ref: RESISTOR; Distributor_part_number: 311-0.0NCT-ND; Distributor_name: DIGIKEY; Package: 0201; Wattage: 1/20W; Tolerance: 5%; Mfr_name: YAGEO AMERICA; Footprint Ref: RES0201_0-5
R118 = RESISTOR: RES 0E 1/20W 5% 0201; Part Reference: R118; Manufacturer: YAGEO AMERICA; Mistral Part No: 110010070067-R; Mfr_part_number: RC0201JR-070RL; Part_type: RESISTORS\FIXED; Project: PB_BUGBASE; Voltage: NA; Customs_HS_Code: 85332119; Custom_Duty: 15%; Value: 0E; PCB Footprint: RES0201_0-5; Footprint Ref: RES0201_0-5; Mfr_name: YAGEO AMERICA; Tolerance: 5%; Wattage: 1/20W; Package: 0201; Distributor_name: DIGIKEY; Distributor_part_number: 311-0.0NCT-ND; Library Ref: RESISTOR; Height: 0.26MM; Weight: 0.17mg; Temperature: -55°C+125°C; Datasheet: Y:\MIS_DATABASE\DATASHEETS\RESISTORS\RCXXXXL-SER_MAR18.PDF; Crtd /date: MUDDU/120710; Chkd/date: NAVEED/301214; MECHANICAL 3D STEP FILE: RES0201_0-5; Library Path: Y:\MIS_DATABASE\Library\ALTIUM_TOOL\SCHEMATICS_PARTS\MS_DISCRETE_Library.schlib; Footprint Path: Y:\MIS_DATABASE\Library\ALTIUM_TOOL\PCB_FOOTPRINTS\Altium_Footprint_Lib.PcbLib
R120 = RESISTOR: RES 0E 1/20W 5% 0201; Part Reference: R120; Manufacturer: YAGEO AMERICA; Mistral Part No: 110010070067-R; Mfr_part_number: RC0201JR-070RL; Part_type: RESISTORS\FIXED; Project: PB_BUGBASE; Voltage: NA; Customs_HS_Code: 85332119; Custom_Duty: 15%; SIGNAL_MODEL: RESISTOR_RES0201_0-5_0E_0E; Value: 0E; PCB Footprint: RES0201_0-5; Footprint Ref: RES0201_0-5; Mfr_name: YAGEO AMERICA; Tolerance: 5%; Wattage: 1/20W; Package: 0201; Distributor_name: DIGIKEY; Distributor_part_number: 311-0.0NCT-ND; Library Ref: RESISTOR; Height: 0.26MM; Weight: 0.17mg; Temperature: -55°C+125°C; Datasheet: Y:\MIS_DATABASE\DATASHEETS\RESISTORS\RCXXXXL-SER_MAR18.PDF; Crtd /date: MUDDU/120710; Chkd/date: NAVEED/301214; MECHANICAL 3D STEP FILE: RES0201_0-5; Library Path: Y:\MIS_DATABASE\Library\ALTIUM_TOOL\SCHEMATICS_PARTS\MS_DISCRETE_Library.schlib; Footprint Path: Y:\MIS_DATABASE\Library\ALTIUM_TOOL\PCB_FOOTPRINTS\Altium_Footprint_Lib.PcbLib
R121 = RESISTOR: RES 0E 1/20W 5% 0201; Part Reference: R121; Manufacturer: YAGEO AMERICA; Part_type: RESISTORS\FIXED; Mfr_part_number: RC0201JR-070RL; Mistral Part No: 110010070067-R; Custom_Duty: 15%; Customs_HS_Code: 85332119; Voltage: NA; Project: PB_BUGBASE; SIGNAL_MODEL: RESISTOR_RES0201_0-5_0E_0E; Value: 0E; PCB Footprint: RES0201_0-5; Footprint Path: Y:\MIS_DATABASE\Library\ALTIUM_TOOL\PCB_FOOTPRINTS\Altium_Footprint_Lib.PcbLib; Library Path: Y:\MIS_DATABASE\Library\ALTIUM_TOOL\SCHEMATICS_PARTS\MS_DISCRETE_Library.schlib; MECHANICAL 3D STEP FILE: RES0201_0-5; Chkd/date: NAVEED/301214; Crtd /date: MUDDU/120710; Datasheet: Y:\MIS_DATABASE\DATASHEETS\RESISTORS\RCXXXXL-SER_MAR18.PDF; Temperature: -55°C+125°C; Weight: 0.17mg; Height: 0.26MM; Library Ref: RESISTOR; Distributor_part_number: 311-0.0NCT-ND; Distributor_name: DIGIKEY; Package: 0201; Wattage: 1/20W; Tolerance: 5%; Mfr_name: YAGEO AMERICA; Footprint Ref: RES0201_0-5
R359 = RESISTOR_Dup2: RES 3.01K 1/20W 1% 0201; Part Reference: R359; Manufacturer: PANASONIC-ECG; Part_type: RESISTORS\FIXED; Mfr_part_number: ERJ-1GNF3011C; Mistral Part No: 110015080044-R; Custom_Duty: 15%; Customs_HS_Code: 85332119; Voltage: NA; Project: J7ES_SOM_DUAL-LEO_PMIC; Value: 3.01K_1%; PCB Footprint: RES0201_0-5; Chkd/date: MANIRAJA/160519; Crtd /date: ALVY/160519; Datasheet: Y:\MIS_DATABASE\DATASHEETS\RESISTORS\PAN-ERJSER_NOV17.PDF; Temperature: -55°C+125°C; Weight: 0.15mg; Height: 0.26MM; Library Ref: RESISTOR; Distributor_part_number: P122916CT-ND; Distributor_name: DIGIKEY; Package: 0201; Wattage: 1/20W; Tolerance: 1%; Mfr_name: PANASONIC-ECG; Footprint Ref: RES0201_0-5; MECHANICAL 3D STEP FILE: RES0201_0-5; Library Path: Y:\MIS_DATABASE\Library\ALTIUM_TOOL\SCHEMATICS_PARTS\MS_DISCRETE_Library.schlib; Footprint Path: Y:\MIS_DATABASE\Library\ALTIUM_TOOL\PCB_FOOTPRINTS\Altium_Footprint_Lib.PcbLib
R376 = RESISTOR_Dup2: RES 3.01K 1/20W 1% 0201; Part Reference: R376; Manufacturer: PANASONIC-ECG; Mistral Part No: 110015080044-R; Mfr_part_number: ERJ-1GNF3011C; Part_type: RESISTORS\FIXED; Project: J7ES_SOM_DUAL-LEO_PMIC; Voltage: NA; Customs_HS_Code: 85332119; Custom_Duty: 15%; Value: 3.01K_1%; PCB Footprint: RES0201_0-5; Footprint Path: Y:\MIS_DATABASE\Library\ALTIUM_TOOL\PCB_FOOTPRINTS\Altium_Footprint_Lib.PcbLib; Library Path: Y:\MIS_DATABASE\Library\ALTIUM_TOOL\SCHEMATICS_PARTS\MS_DISCRETE_Library.schlib; MECHANICAL 3D STEP FILE: RES0201_0-5; Footprint Ref: RES0201_0-5; Mfr_name: PANASONIC-ECG; Tolerance: 1%; Wattage: 1/20W; Package: 0201; Distributor_name: DIGIKEY; Distributor_part_number: P122916CT-ND; Library Ref: RESISTOR; Height: 0.26MM; Weight: 0.15mg; Temperature: -55°C+125°C; Datasheet: Y:\MIS_DATABASE\DATASHEETS\RESISTORS\PAN-ERJSER_NOV17.PDF; Crtd /date: ALVY/160519; Chkd/date: MANIRAJA/160519
R379 = RESISTOR_Dup2: RES 3.01K 1/20W 1% 0201; Part Reference: R379; Manufacturer: PANASONIC-ECG; Part_type: RESISTORS\FIXED; Mfr_part_number: ERJ-1GNF3011C; Mistral Part No: 110015080044-R; Custom_Duty: 15%; Customs_HS_Code: 85332119; Voltage: NA; Project: J7ES_SOM_DUAL-LEO_PMIC; Value: 3.01K_1%; PCB Footprint: RES0201_0-5; Chkd/date: MANIRAJA/160519; Crtd /date: ALVY/160519; Datasheet: Y:\MIS_DATABASE\DATASHEETS\RESISTORS\PAN-ERJSER_NOV17.PDF; Temperature: -55°C+125°C; Weight: 0.15mg; Height: 0.26MM; Library Ref: RESISTOR; Distributor_part_number: P122916CT-ND; Distributor_name: DIGIKEY; Package: 0201; Wattage: 1/20W; Tolerance: 1%; Mfr_name: PANASONIC-ECG; Footprint Ref: RES0201_0-5; MECHANICAL 3D STEP FILE: RES0201_0-5; Library Path: Y:\MIS_DATABASE\Library\ALTIUM_TOOL\SCHEMATICS_PARTS\MS_DISCRETE_Library.schlib; Footprint Path: Y:\MIS_DATABASE\Library\ALTIUM_TOOL\PCB_FOOTPRINTS\Altium_Footprint_Lib.PcbLib
TP104 = TESTPOINT_Dup1: TESTPOINT CIR 40 SMD; Part Reference: TP104; Mfr_name: LOCAL; Mistral Part No: 130009030933; MECHANICAL 3D STEP FILE: NA; Project: RAINIER-3; Value: TP40_SMD; PCB Footprint: TP40_SMD; Footprint Ref: TP40_SMD; Library Ref: TESTPOINT; Footprint Path: Y:\MIS_DATABASE\Library\ALTIUM_TOOL\PCB_FOOTPRINTS\Altium_Footprint_Lib.PcbLib; Library Path: Y:\MIS_DATABASE\Library\ALTIUM_TOOL\SCHEMATICS_PARTS\MS_DISCRETE_Library.schlib; Chkd/date: MAZHAR/190505; Crtd /date: MAZHAR/190505; Datasheet: NA; Temperature: NA; Weight: NA; Height: NA; Distributor_part_number: NA; Distributor_name: NA; Package: SMD; Wattage: NA; Voltage: NA; Tolerance: NA; Part_type: TESTPOINT; Mfr_part_number: TP40_SMD; RoHS: NA; Manufacturer: LOCAL
TP105 = TESTPOINT_Dup1: TESTPOINT CIR 40 SMD; Part Reference: TP105; Mfr_name: LOCAL; Mistral Part No: 130009030933; MECHANICAL 3D STEP FILE: NA; Project: RAINIER-3; Value: TP40_SMD; PCB Footprint: TP40_SMD; Footprint Ref: TP40_SMD; Library Ref: TESTPOINT; Footprint Path: Y:\MIS_DATABASE\Library\ALTIUM_TOOL\PCB_FOOTPRINTS\Altium_Footprint_Lib.PcbLib; Library Path: Y:\MIS_DATABASE\Library\ALTIUM_TOOL\SCHEMATICS_PARTS\MS_DISCRETE_Library.schlib; Chkd/date: MAZHAR/190505; Crtd /date: MAZHAR/190505; Datasheet: NA; Temperature: NA; Weight: NA; Height: NA; Distributor_part_number: NA; Distributor_name: NA; Package: SMD; Wattage: NA; Voltage: NA; Tolerance: NA; Part_type: TESTPOINT; Mfr_part_number: TP40_SMD; RoHS: NA; Manufacturer: LOCAL
TP110 = TESTPOINT_Dup1: TESTPOINT CIR 40 SMD; Part Reference: TP110; Manufacturer: LOCAL; Mistral Part No: 130009030933; Project: RAINIER-3; Tolerance: NA; Value: TP40_SMD; PCB Footprint: TP40_SMD; RoHS: NA; Mfr_name: LOCAL; Mfr_part_number: TP40_SMD; Part_type: TESTPOINT; Voltage: NA; Wattage: NA; Package: SMD; Distributor_name: NA; Distributor_part_number: NA; Height: NA; Weight: NA; Temperature: NA; Datasheet: NA; Crtd /date: MAZHAR/190505; Chkd/date: MAZHAR/190505; MECHANICAL 3D STEP FILE: NA; Library Path: Y:\MIS_DATABASE\Library\ALTIUM_TOOL\SCHEMATICS_PARTS\MS_DISCRETE_Library.schlib; Footprint Path: Y:\MIS_DATABASE\Library\ALTIUM_TOOL\PCB_FOOTPRINTS\Altium_Footprint_Lib.PcbLib; Library Ref: TESTPOINT; Footprint Ref: TP40_SMD
TP111 = TESTPOINT_Dup1: TESTPOINT CIR 40 SMD; Part Reference: TP111; Manufacturer: LOCAL; Mistral Part No: 130009030933; Project: RAINIER-3; Tolerance: NA; Value: TP40_SMD; PCB Footprint: TP40_SMD; RoHS: NA; Mfr_name: LOCAL; Mfr_part_number: TP40_SMD; Part_type: TESTPOINT; Voltage: NA; Wattage: NA; Package: SMD; Distributor_name: NA; Distributor_part_number: NA; Height: NA; Weight: NA; Temperature: NA; Datasheet: NA; Crtd /date: MAZHAR/190505; Chkd/date: MAZHAR/190505; MECHANICAL 3D STEP FILE: NA; Library Path: Y:\MIS_DATABASE\Library\ALTIUM_TOOL\SCHEMATICS_PARTS\MS_DISCRETE_Library.schlib; Footprint Path: Y:\MIS_DATABASE\Library\ALTIUM_TOOL\PCB_FOOTPRINTS\Altium_Footprint_Lib.PcbLib; Library Ref: TESTPOINT; Footprint Ref: TP40_SMD
U28 = J7AHPSoC-EVM_BGA1414: IC AM69 SoC EVM MICROPROCESSOR BGA1414; Part Reference: U28; Mistral Part No: 141230020002; Mfr_name: TEXAS INSTRUMENTS; Part_type: ICS\DIGITAL\MICROPROCESSOR; SPLIT_INST: TRUE; SWAP_INFO: (S1+S2+S3+S4+S5+S6+S7+S8+S9+S10+S11+S12+S13+S14+S15+S16+S17+S18+S19+S20+S21+S22+S23+S24+S25+S26); Project: TI_J7AHP SK_BRD; Tolerance: NA; Customs_HS_Code: 85423100; Custom_Duty: 15%; Value: XJ784S45AALY; Footprint Ref: BGA1414_31-49_1230X1230_2-7; Mfr_part_number: XJ784S45AALY; Voltage: NA; Wattage: NA; Package: BGA1414; Distributor_name: NA; Distributor_part_number: NA; Library Ref: J7AHPSoC-EVM_BGA1414; Height: 2.70MM; Weight: NA; Temperature: NA; Datasheet: Y:\MIS_DATABASE\DATASHEETS\ICS\DIGITAL\MICROCONTROLLER\J7AHP-SoC-EVM.PDF; Crtd /date: ALVY/141221; Chkd/date: MANIRAJA/151221; RoHS: NA; MECHANICAL 3D STEP FILE: BGA1414_31-49_1230X1230_2-7; Library Path: Y:\MIS_DATABASE\Library\ALTIUM_TOOL\SCHEMATICS_PARTS\MS_MICROPROCESSOR_Library.schlib; Footprint Path: Y:\MIS_DATABASE\Library\ALTIUM_TOOL\PCB_FOOTPRINTS\Altium_Footprint_Lib.PcbLib; Manufacturer: TEXAS INSTRUMENTS; PCB Footprint: BGA1414_31-49_1230X1230_2-7